# EAGLE schematic YaoGuai_SOUND_v1 (EAGLE 8.1.1)
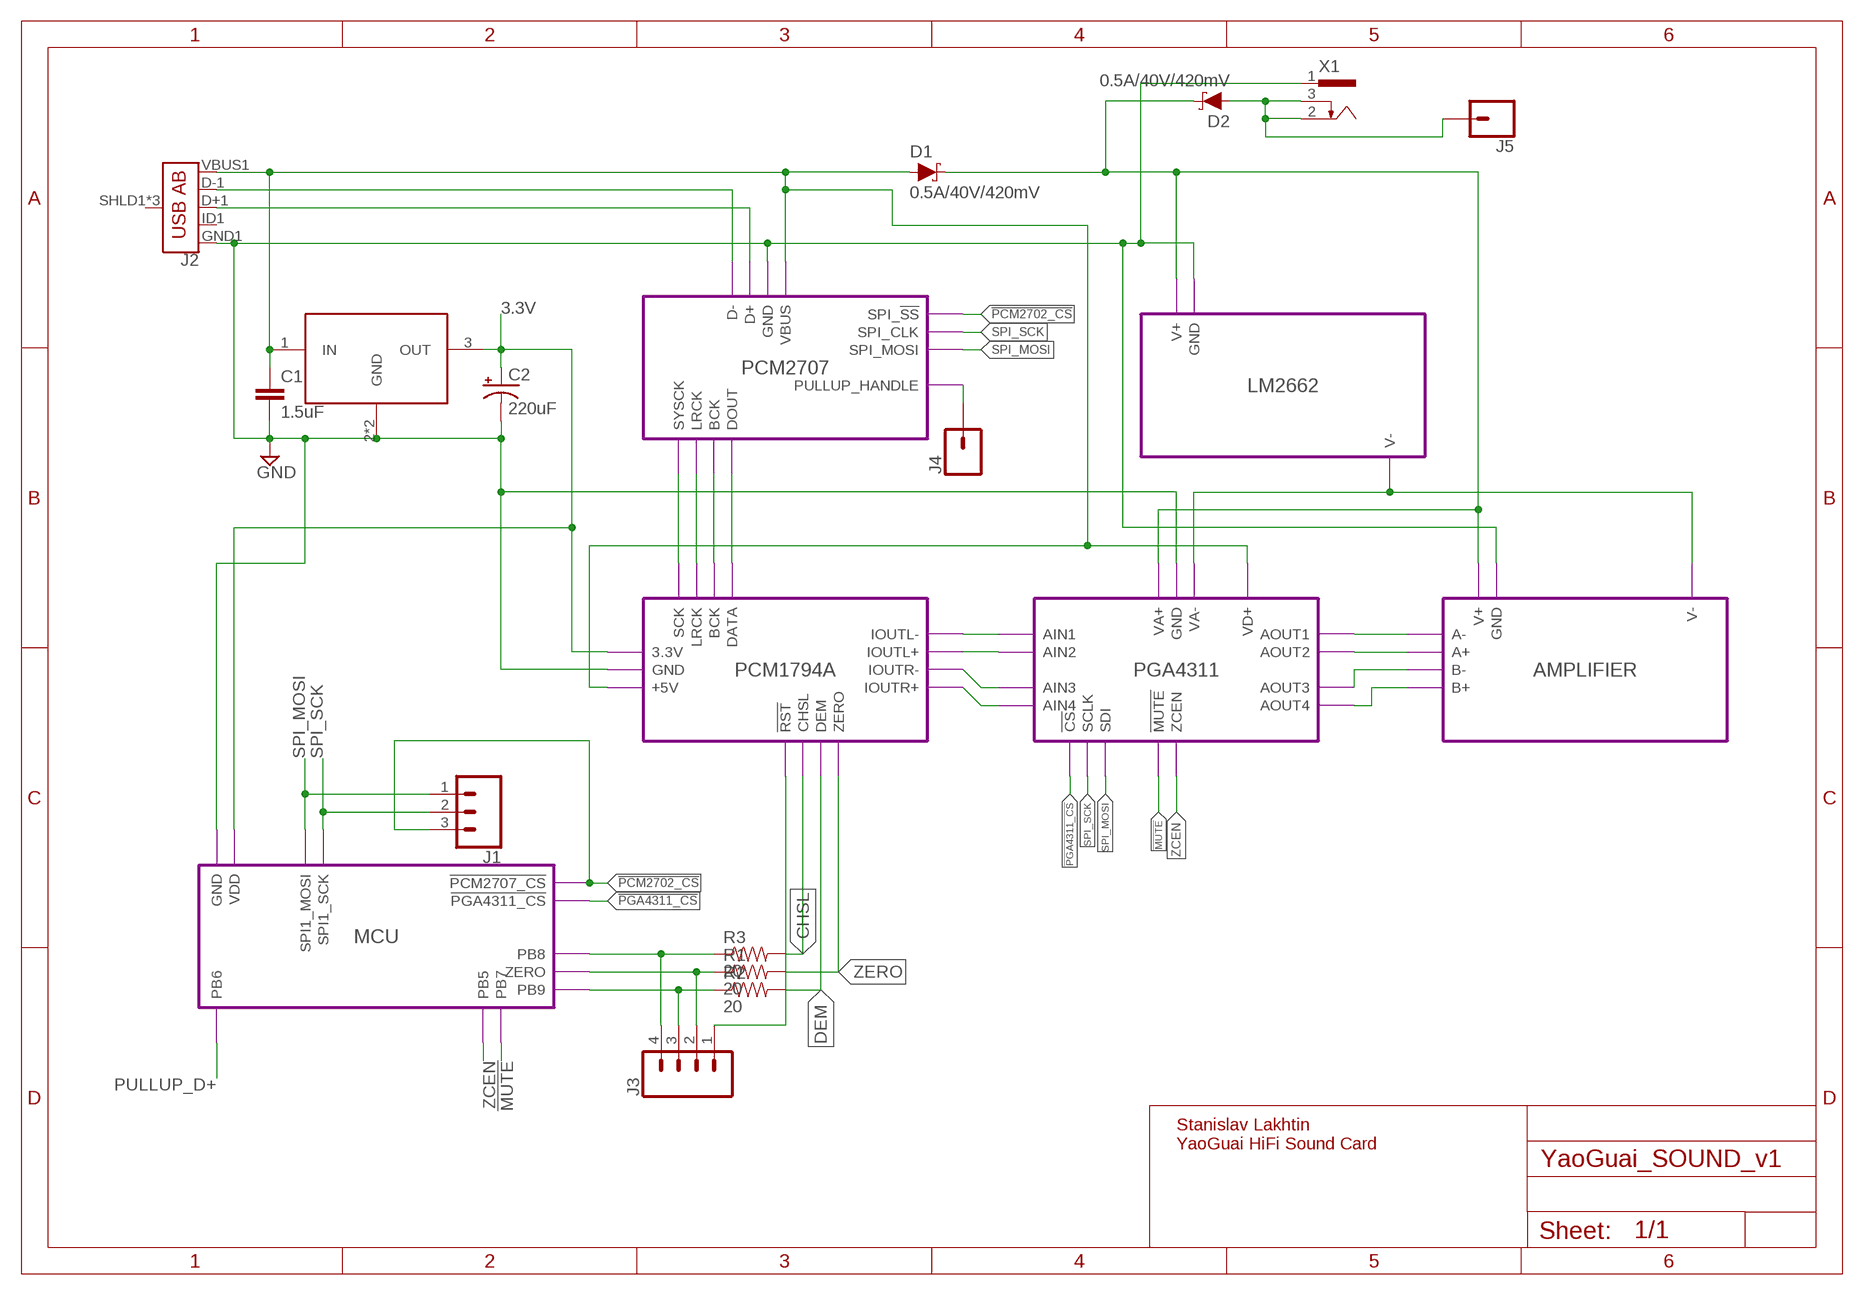
[diagram p0: schematic, sheet 1]

## Parts
C1  1.5uF  CAP0805  [0805]
C2  220uF  CAP_POLD  [PANASONIC_D]
D1  0.5A/40V/420mV  DIODE-SCHOTTKY-PMEG4005EJ  [SOD-323]
D2  0.5A/40V/420mV  DIODE-SCHOTTKY-PMEG4005EJ  [SOD-323]
J1  CONN_03  [1X03]
J2  USB_AB_SMT  [USB-AB-MICRO-SMD]
J3  CONN_04  [1X04]
J4  CONN_01  [1X01]
J5  CONN_01  [1X01]
R1  20  RESISTOR0805-RES  [0805]
R2  20  RESISTOR0805-RES  [0805]
R3  20  RESISTOR0805-RES  [0805]
U$1  LM3940IMP-3.3/NOPB  [SOT223]
X1  733980-62  [733980-62]

## Module instances
PCM2707 = PCM2707
LM2662 = VOLTAGE_CONVERTER
PCM1794A = PCM1794A
AMPLIFIER = AMPLIFIER
PGA4311 = PGA4311
MCU = MCU

## Nets
3.3V: C2.+ U$1.3(OUT) ; port PCM1794A.3.3V MCU.VDD
!MUTE!: port MCU.PB7 PGA4311.!MUTE!
!PCM2702_CS!: J1.3 ; port PCM2707.SPI_!SS! MCU.!PCM2707_CS!
!PGA4311_CS!: port PGA4311.!CS! MCU.!PGA4311_CS!
CHSL: R3.2 ; port PCM1794A.CHSL
DEM: R2.2 ; port PCM1794A.DEM
EXT+5V: D2.A J5.1 X1.2 X1.3
GND: C1.2 C2.- J2.GND1(GND) U$1.2(GND) U$1.4(GND) X1.1 ; port PCM1794A.GND PGA4311.GND MCU.GND PCM2707.GND AMPLIFIER.GND LM2662.GND
N$1: J2.D-1(D-) ; port PCM2707.D-
N$2: J2.D+1(D+) ; port PCM2707.D+
N$3: port PCM1794A.IOUTL- PGA4311.AIN1
N$4: port PGA4311.AIN2 PCM1794A.IOUTL+
N$5: port PCM1794A.SCK PCM2707.SYSCK
N$6: port PCM1794A.LRCK PCM2707.LRCK
N$7: port PCM1794A.BCK PCM2707.BCK
N$8: port PCM1794A.DATA PCM2707.DOUT
N$9: port PCM1794A.IOUTR- PGA4311.AIN3
N$10: port PCM1794A.IOUTR+ PGA4311.AIN4
N$11: J3.2 R1.1 ; port MCU.ZERO
N$12: J3.3 R2.1 ; port MCU.PB9
N$13: J3.4 R3.1 ; port MCU.PB8
N$14: J3.1 ; port PCM1794A.!RST!
N$20: port PGA4311.AOUT3 AMPLIFIER.B-
N$21: port PGA4311.AOUT4 AMPLIFIER.B+
N$22: port PGA4311.AOUT2 AMPLIFIER.A+
N$23: port PGA4311.AOUT1 AMPLIFIER.A-
PULLUP_D+: J4.1 ; port PCM2707.PULLUP_HANDLE MCU.PB6
SPI_MOSI: J1.1 ; port MCU.SPI1_MOSI PGA4311.SDI PCM2707.SPI_MOSI
SPI_SCK: J1.2 ; port PGA4311.SCLK MCU.SPI1_SCK PCM2707.SPI_CLK
USB+5V: C1.1 D1.A J2.VBUS1(VBUS) U$1.1(IN) ; port PCM2707.VBUS PCM1794A.+5V PGA4311.VD+
V+: D1.C D2.C ; port AMPLIFIER.V+ PGA4311.VA+ LM2662.V+
V-: port LM2662.V- AMPLIFIER.V- PGA4311.VA-
ZCEN: port MCU.PB5 PGA4311.ZCEN
ZERO: R1.2 ; port PCM1794A.ZERO
Unconnected: J2.ID1(USBID) J2.SHLD1(SHIELD) J2.SHLD2(SHIELD) J2.SHLD3(SHIELD)

## Notes on the sheet
- Stanislav Lakhtin 
  YaoGuai HiFi Sound Card

## Library data of the parts
C1 = SparkFun-Passives:CAP: Capacitor Standard 0603 ceramic capacitor, and 0.1" leaded capacitor.
C2 = SparkFun-Passives:CAP_POL: Capacitor Polarized These are standard SMD and PTH capacitors. Normally 10uF, 47uF, and 100uF in electrolytic and tantalum varieties. Always verify the external diameter of the through hole cap, it varies with capacity, voltage, and manufacturer. The EIA devices should be standard.
D1 D2 = SparkFun-DiscreteSemi:DIODE-SCHOTTKY: Schottky diode A Schottky diode is a semiconductor diode which has a low forward voltage drop and a very fast switching action.; PROD_ID: DIO-10955
J1 = SparkFun-Connectors:CONN_03: Multi connection point. Often used as Generic Header-pin footprint for 0.1 inch spaced/style header connections On any of the 0.1 inch spaced packages, you can populate with these: Break Away Headers - Straight <https://www.sparkfun.com/products/116> (PRT-00116) Break Away Male Headers - Right Angle <https://www.sparkfun.com/products/553> (PRT-00553) Female Headers <https://www.sparkfun.com/products/115> (PRT-00115) Break Away Headers - Machine Pin <https://www.sparkfun.com/products/117> (PRT-00117) Break Away Female Headers - Swiss Machine Pin <https://www.sparkfun.com/products/743> (PRT-00743) Stackable Header - 3 Pin (Female, 0.1") <https://www.sparkfun.com/products/13875> (PRT-13875) For SCREWTERMINALS and SPRING TERMINALS visit here: Screw Terimnals on SparkFun.com <https://www.sparkfun.com/search/results?term=Screw+Terminals> (5mm/3.5mm/2.54mm spacing) This device is also useful as a general connection point to wire up your design to another part of your project. Our various solder wires solder well into these plated through hole pads. Hook-Up Wire - Assortment (Stranded, 22 AWG) <https://www.sparkfun.com/products/11375> (PRT-11375) Hook-Up Wire - Assortment (Solid Core, 22 AWG) <https://www.sparkfun.com/products/11367> (PRT-11367) View the entire wire category on our website here <https://www.sparkfun.com/categories/141> Special notes: Molex polarized connector foot print use with SKU : PRT-08232 with associated crimp pins and housings.
J2 = SparkFun-Connectors:USB_AB: USB Type AB Micro Connector OTG-compatible. 5 pins, 3 shield pins SparkFun Products: IOIO-OTG <https://www.sparkfun.com/products/13613> SparkFun SAMD21 Mini Breakout <https://www.sparkfun.com/products/13664>; PROD_ID: CONN-11794
J3 = SparkFun-Connectors:CONN_04: Multi connection point. Often used as Generic Header-pin footprint for 0.1 inch spaced/style header connections On any of the 0.1 inch spaced packages, you can populate with these: Break Away Headers - Straight <https://www.sparkfun.com/products/116> (PRT-00116) Break Away Male Headers - Right Angle <https://www.sparkfun.com/products/553> (PRT-00553) Female Headers <https://www.sparkfun.com/products/115> (PRT-00115) Break Away Headers - Machine Pin <https://www.sparkfun.com/products/117> (PRT-00117) Break Away Female Headers - Swiss Machine Pin <https://www.sparkfun.com/products/743> (PRT-00743) For SCREWTERMINALS and SPRING TERMINALS visit here: Screw Terimnals on SparkFun.com <https://www.sparkfun.com/search/results?term=Screw+Terminals> (5mm/3.5mm/2.54mm spacing) This device is also useful as a general connection point to wire up your design to another part of your project. Our various solder wires solder well into these plated through hole pads. Hook-Up Wire - Assortment (Stranded, 22 AWG) <https://www.sparkfun.com/products/11375> (PRT-11375) Hook-Up Wire - Assortment (Solid Core, 22 AWG) <https://www.sparkfun.com/products/11367> (PRT-11367) View the entire wire category on our website here <https://www.sparkfun.com/categories/141> Special notes: Molex polarized connector foot print use with SKU : PRT-08231 with associated crimp pins and housings. 1MM SMD Version SKU: PRT-10208; PROD_ID: CONN-09696
J4 J5 = SparkFun-Connectors:CONN_01: Single connection point. Often used as Generic Header-pin footprint for 0.1 inch spaced/style header connections On any of the 0.1 inch spaced packages, you can populate with these: Break Away Headers - Straight <https://www.sparkfun.com/products/116> (PRT-00116) Break Away Male Headers - Right Angle <https://www.sparkfun.com/products/553> (PRT-00553) Female Headers <https://www.sparkfun.com/products/115> (PRT-00115) Break Away Headers - Machine Pin <https://www.sparkfun.com/products/117> (PRT-00117) Break Away Female Headers - Swiss Machine Pin <https://www.sparkfun.com/products/743> (PRT-00743) This device is also useful as a general connection point to wire up your design to another part of your project. Our various solder wires solder well into these plated through hole pads. Hook-Up Wire - Assortment (Stranded, 22 AWG) <https://www.sparkfun.com/products/11375> (PRT-11375) Hook-Up Wire - Assortment (Solid Core, 22 AWG) <https://www.sparkfun.com/products/11367> (PRT-11367) View the entire wire category on our website here <https://www.sparkfun.com/categories/141> Special notes: SMTSO-256-ET is a "flush mount" nut for a 4-40 screw. We mostly use this on specialty testbeds; it is a nice way to connect hardware to your PCB at an adjustable hieght. Also note, the SNAP packages are for using a snappable style connector. We sell a baggie of snaps and they are also used on two LilyPad designs: Snap Assortment - 30 pack (male and female) <https://www.sparkfun.com/products/11347> (DEV-11347) LilyPad Arduino SimpleSnap <https://www.sparkfun.com/products/10941> (DEV-10941) LilyPad SimpleSnap Protoboard <https://www.sparkfun.com/products/10940> (DEV-10940)
R1-R3 = SparkFun-Passives:RESISTOR: Resistor Basic schematic elements and footprints for 0603, 1206, and PTH resistors.
U$1 = EduAreaLib:LM3940IMP-3.3/NOPB
X1 = con-conrad:73398?: FEMALE PRINT CONNECTOR Niedervolt-Steckverbinder Distributor Conrad

## Module PCM2707
Ports: D+(io) D-(io) GND(pwr) VBUS(pwr) SYSCK(io) LRCK(io) BCK(io) DOUT(io) SPI_!SS!(io) SPI_CLK(io) SPI_MOSI(io) PULLUP_HANDLE(io)
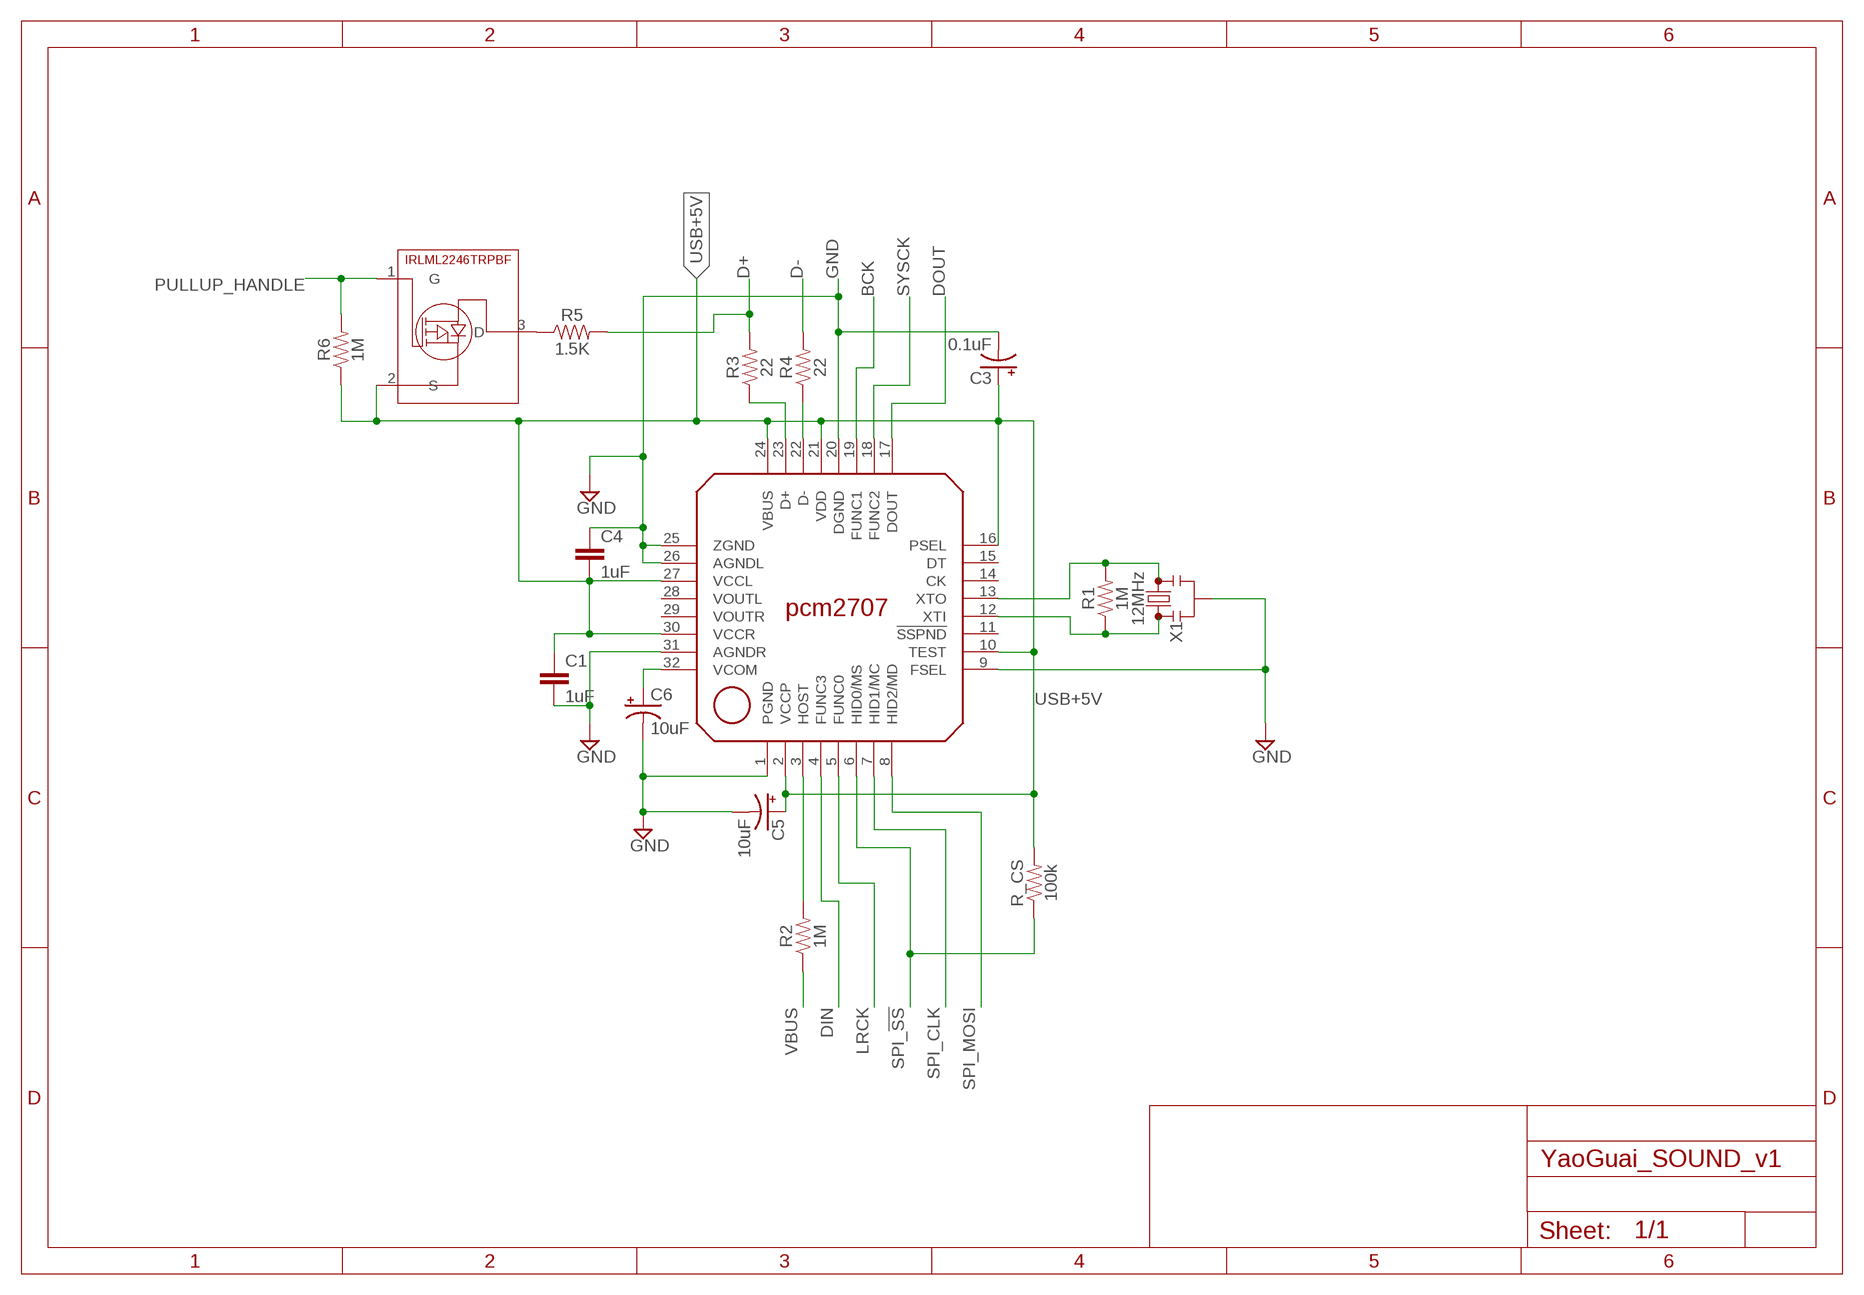
[diagram p1: schematic, module PCM2707, sheet 1]

### Parts
C1  1uF  CAP0805  [0805]
C3  0.1uF  CAP_POLD  [PANASONIC_D]
C4  1uF  CAP0805  [0805]
C5  10uF  CAP_POLD  [PANASONIC_D]
C6  10uF  CAP_POLD  [PANASONIC_D]
R1  1M  RESISTOR0805  [0805]
R2  1M  RESISTOR0805  [0805]
R3  22  RESISTOR0805  [0805]
R4  22  RESISTOR0805  [0805]
R5  1.5K  RESISTOR0805  [0805]
R6  1M  RESISTOR0805  [0805]
R_CS  100k  RESISTOR0805  [0805]
U$1  PCM2707  [TQFP32-0.8-7X7MM]
U$2  IRLML2246TRPBF  [SOT23-3]
X1  12MHz  RESONATOR-8MHZSMD_3.2X1.3  [RESONATOR-SMD-3.2X1.3]

### Nets
BCK: U$1.19(FUNC1)
D+: R3.2 R5.2
D-: R4.2
DIN: U$1.4(FUNC3)
DOUT: U$1.17(DOUT)
GND: C1.2 C3.- C4.1 C5.- C6.- U$1.1(PGND) U$1.9(FSEL) U$1.20(DGND) U$1.25(ZGND) U$1.26(AGNDL) U$1.31(AGNDR) X1.2
INTRNL_D+: R3.1 U$1.23(D+)
INTRNL_D-: R4.1 U$1.22(D-)
INTRNL_HOST: R2.2 U$1.3(HOST)
LRCK: U$1.5(FUNC0)
N$9: R5.1 U$2.3(D)
PULLUP_HANDLE: R6.2 U$2.1(G)
RESONATOR_XTI: R1.1 U$1.12(XTI) X1.1
RESONATOR_XTO: R1.2 U$1.13(XTO) X1.3
SPI_!SS!: R_CS.1 U$1.6(HID0/MS)
SPI_CLK: U$1.7(HID1/MC)
SPI_MOSI: U$1.8(HID2/MD)
SYSCK: U$1.18(FUNC2)
USB+5V: C1.1 C3.+ C4.2 C5.+ R6.1 R_CS.2 U$1.2(VCCP) U$1.10(TEST) U$1.16(PSEL) U$1.21(VDD) U$1.24(VBUS) U$1.27(VCCL) U$1.30(VCCR) U$2.2(S)
VBUS: R2.1
VCOM: C6.+ U$1.32(VCOM)
Unconnected: U$1.11(!SSPND!) U$1.14(CK) U$1.15(DT) U$1.28(VOUTL) U$1.29(VOUTR)

### Library data of the parts
C1 C4 = SparkFun-Passives:CAP: Capacitor Standard 0603 ceramic capacitor, and 0.1" leaded capacitor.
C3 C5 C6 = SparkFun-Passives:CAP_POL: Capacitor Polarized These are standard SMD and PTH capacitors. Normally 10uF, 47uF, and 100uF in electrolytic and tantalum varieties. Always verify the external diameter of the through hole cap, it varies with capacity, voltage, and manufacturer. The EIA devices should be standard.
R1-R6 R_CS = SparkFun-Resistors:RESISTOR: Generic Resistor Package
U$1 = EduAreaLib:PCM2707
U$2 = EduAreaLib:IRLML2246TRPBF
X1 = SparkFun-Clocks:RESONATOR-8MHZ: 8MHz Resonator Digikey Example <http://www.digikey.com/product-detail/en/murata-electronics-north-america/CSTCE10M0G55-R0/490-1196-1-ND/584633> Frequency: 8MHz Frequency Stability: ±0.2% Frequency Tolerance: ±0.5% Capacitance: 33pF SparkFun Products Arduino Pro Mini 328- 3.3V/8MHz <https://www.sparkfun.com/products/11114> SparkFun Digital Sandbox <https://www.sparkfun.com/products/12651>; PROD_ID: XTAL-08895; VALUE: 8MHz

## Module VOLTAGE_CONVERTER
Ports: GND(pwr) V+(pwr) V-(pwr)
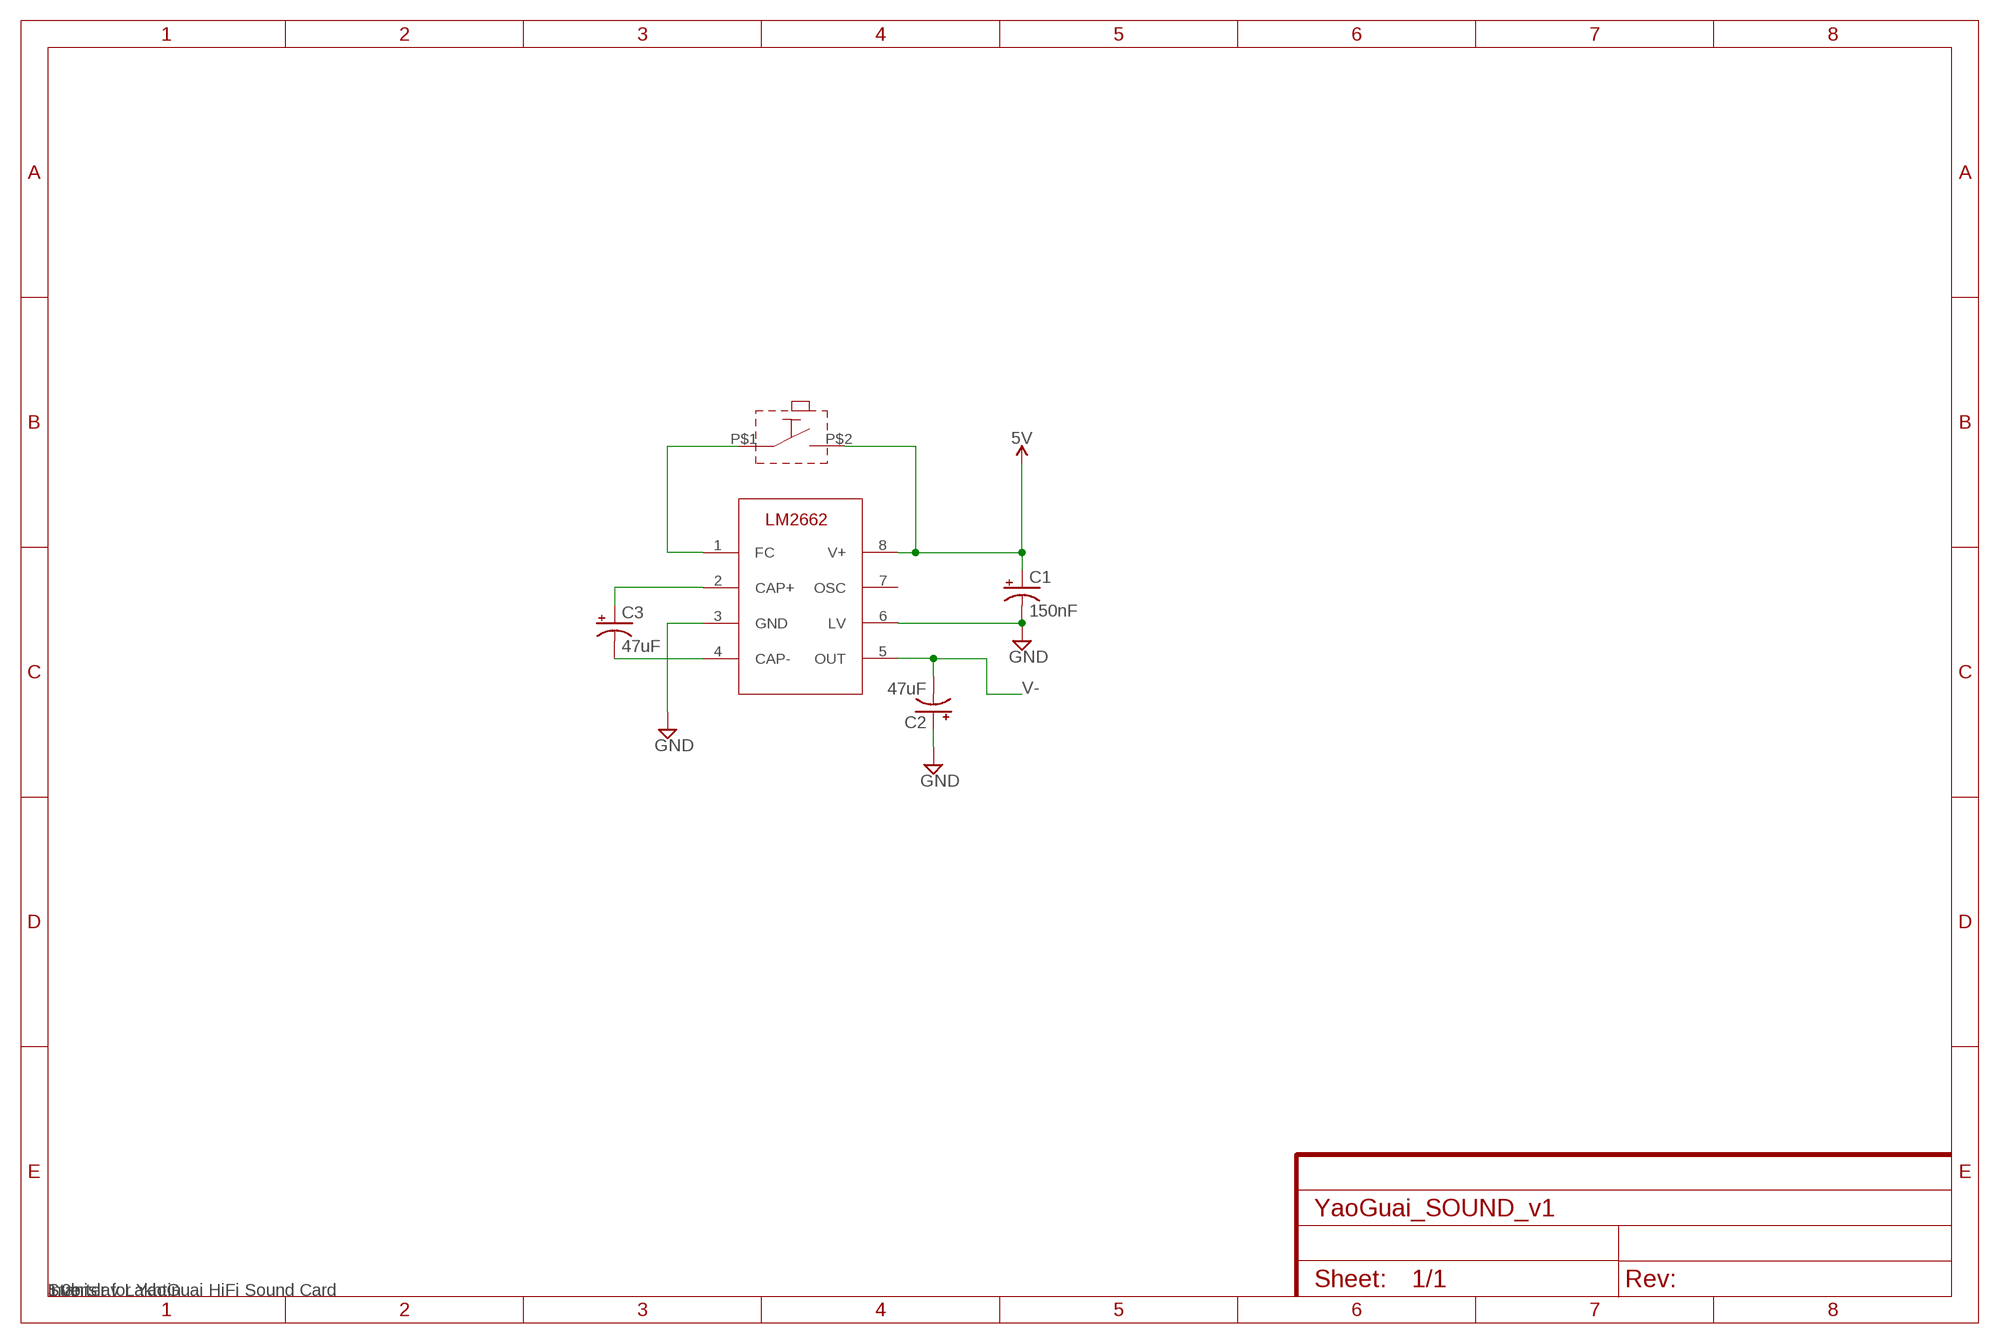
[diagram p2: schematic, module VOLTAGE_CONVERTER, sheet 1]
FRAME1 (FRAME-A4L): CNAME: Inverter for YaoGuai HiFi Sound Card; CREVISION: 1.0b; DESIGNER: Stanislav Lakhtin

### Parts
C1  150nF  CAP_POLD  [PANASONIC_D]
C2  47uF  CAP_POLD  [PANASONIC_D]
C3  47uF  CAP_POLD  [PANASONIC_D]
U$1  LM2662  [SOIC-8]
U$2  RED_SWITCH_ON  [RED_SWITCH]

### Nets
FC: U$1.1(FC) U$2.P$1
GND: C1.- C2.+ U$1.3(GND) U$1.6(LV)
N$1: C3.+ U$1.2(CAP+)
N$2: C3.- U$1.4(CAP-)
V+: C1.+ U$1.8(V+) U$2.P$2 ; supply symbol labelled 5V
V-: C2.- U$1.5(OUT)
Unconnected: U$1.7(OSC)

### Library data of the parts
C1-C3 = SparkFun-Passives:CAP_POL: Capacitor Polarized These are standard SMD and PTH capacitors. Normally 10uF, 47uF, and 100uF in electrolytic and tantalum varieties. Always verify the external diameter of the through hole cap, it varies with capacity, voltage, and manufacturer. The EIA devices should be standard.
U$1 = EduAreaLib:LM2662: The LM2662/LM2663 CMOS charge-pump voltage converter inverts a positive voltage in the range of 1.5 V to 5.5 V to the corresponding negative voltage. The LM2662/LM2663 uses two low cost capacitors to provide 200 mA of output current without the cost, size, and EMI related to inductor based converters. With an operating current of only 300 μA and operating efficiency greater than 90% at most loads, the LM2662/LM2663 provides ideal performance for battery powered systems. The LM2662/LM2663 may also be used as a positive voltage doubler. The oscillator frequency can be lowered by adding an external capacitor to the OSC pin. Also, the OSC pin may be used to drive the LM2662/LM2663 with an external clock. For LM2662, a frequency control (FC) pin selects the oscillator frequency of 20 kHz or 150 kHz. For LM2663, an external shutdown (SD) pin replaces the FC pin. The SD pin can be used to disable the device and reduce the quiescent current to 10 μA. The oscillator frequency for LM2663 is 150 kHz.
U$2 = EduAreaLib:RED_SWITCH_ON

## Module PCM1794A
Ports: SCK(io) LRCK(io) BCK(io) DATA(io) 3.3V(pwr) GND(pwr) IOUTL-(out) IOUTL+(out) IOUTR-(out) IOUTR+(out) !RST!(io) CHSL(io) DEM(io) ZERO(io) +5V(io)
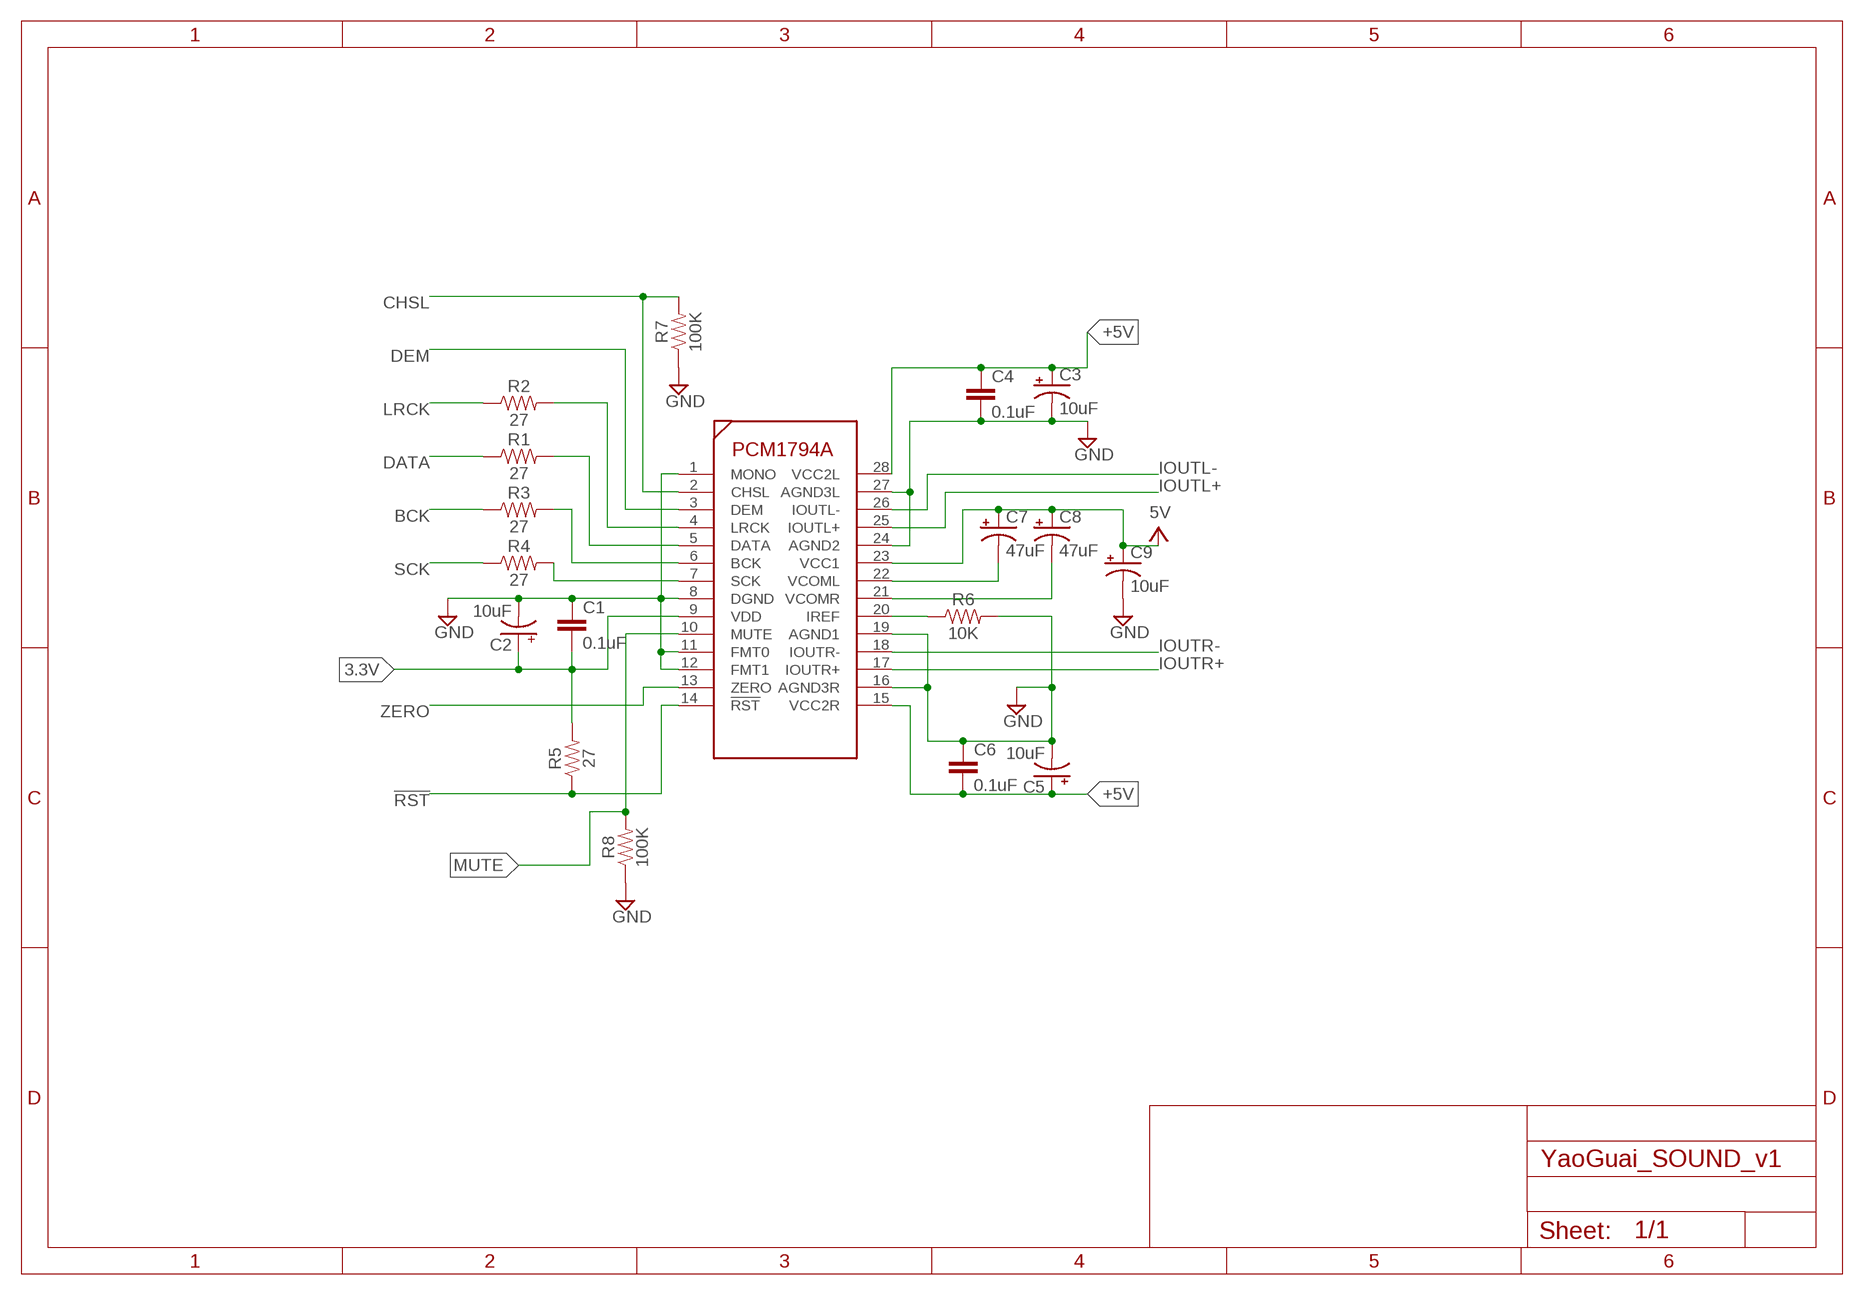
[diagram p3: schematic, module PCM1794A, sheet 1]

### Parts
C1  0.1uF  CAP0805  [0805]
C2  10uF  CAP_POLD  [PANASONIC_D]
C3  10uF  CAP_POLD  [PANASONIC_D]
C4  0.1uF  CAP0805  [0805]
C5  10uF  CAP_POLD  [PANASONIC_D]
C6  0.1uF  CAP0805  [0805]
C7  47uF  CAP_POLD  [PANASONIC_D]
C8  47uF  CAP_POLD  [PANASONIC_D]
C9  10uF  CAP_POLD  [PANASONIC_D]
R1  27  RESISTOR0805  [0805]
R2  27  RESISTOR0805  [0805]
R3  27  RESISTOR0805  [0805]
R4  27  RESISTOR0805  [0805]
R5  27  RESISTOR0805  [0805]
R6  10K  RESISTOR0805  [0805]
R7  100K  RESISTOR0805  [0805]
R8  100K  RESISTOR0805  [0805]
U$1  PCM1794A  [SSOP28-0.65-10.2X5.2MM]

### Nets
3.3V: C1.2 C2.+ R5.2 U$1.9(VDD)
!RST!: R5.1 U$1.14(!RST!)
+5V: C3.+ C4.1 C5.+ C6.2 U$1.15(VCC2R) U$1.28(VCC2L)
BCK: R3.1
CHSL: R7.2 U$1.2(CHSL)
DATA: R1.1
DEM: U$1.3(DEM)
GND: C1.1 C2.- C3.- C4.2 C5.- C6.1 C9.- R6.2 R7.1 R8.1 U$1.1(MONO) U$1.8(DGND) U$1.11(FMT0) U$1.12(FMT1) U$1.16(AGND3R) U$1.19(AGND1) U$1.24(AGND2) U$1.27(AGND3L)
IOUTL+: U$1.25(IOUTL+)
IOUTL-: U$1.26(IOUTL-)
IOUTR+: U$1.17(IOUTR+)
IOUTR-: U$1.18(IOUTR-)
LRCK: R2.1
MUTE: R8.2 U$1.10(MUTE)
N$1: R4.2 U$1.7(SCK)
N$2: R3.2 U$1.6(BCK)
N$3: R1.2 U$1.5(DATA)
N$4: R6.1 U$1.20(IREF)
N$5: R2.2 U$1.4(LRCK)
N$9: C7.- U$1.22(VCOML)
N$10: C8.- U$1.21(VCOMR)
SCK: R4.1
V+: C7.+ C8.+ C9.+ U$1.23(VCC1) ; supply symbol labelled 5V
ZERO: U$1.13(ZERO)

### Library data of the parts
C1 C4 C6 = SparkFun-Passives:CAP: Capacitor Standard 0603 ceramic capacitor, and 0.1" leaded capacitor.
C2 C3 C5 C7-C9 = SparkFun-Passives:CAP_POL: Capacitor Polarized These are standard SMD and PTH capacitors. Normally 10uF, 47uF, and 100uF in electrolytic and tantalum varieties. Always verify the external diameter of the through hole cap, it varies with capacity, voltage, and manufacturer. The EIA devices should be standard.
R1-R8 = SparkFun-Resistors:RESISTOR: Generic Resistor Package
U$1 = EduAreaLib:PCM1794A: The PCM1794A device is a monolithic, CMOS-integrated circuit that includes stereo digital-to-analog converters (DACs) and support circuitry in a small 28-pin SSOP package. The data converters use TI’s advanced segment DAC architecture to achieve excellent dynamic performance and improved tolerance to clock jitter. The PCM1794A device provides balanced current outputs, allowing the user to optimize analog performance externally. Sampling rates up to 200 kHz are supported.

## Module AMPLIFIER
Ports: A-(in) A+(in) B-(in) B+(in) V-(pwr) V+(pwr) GND(pwr)
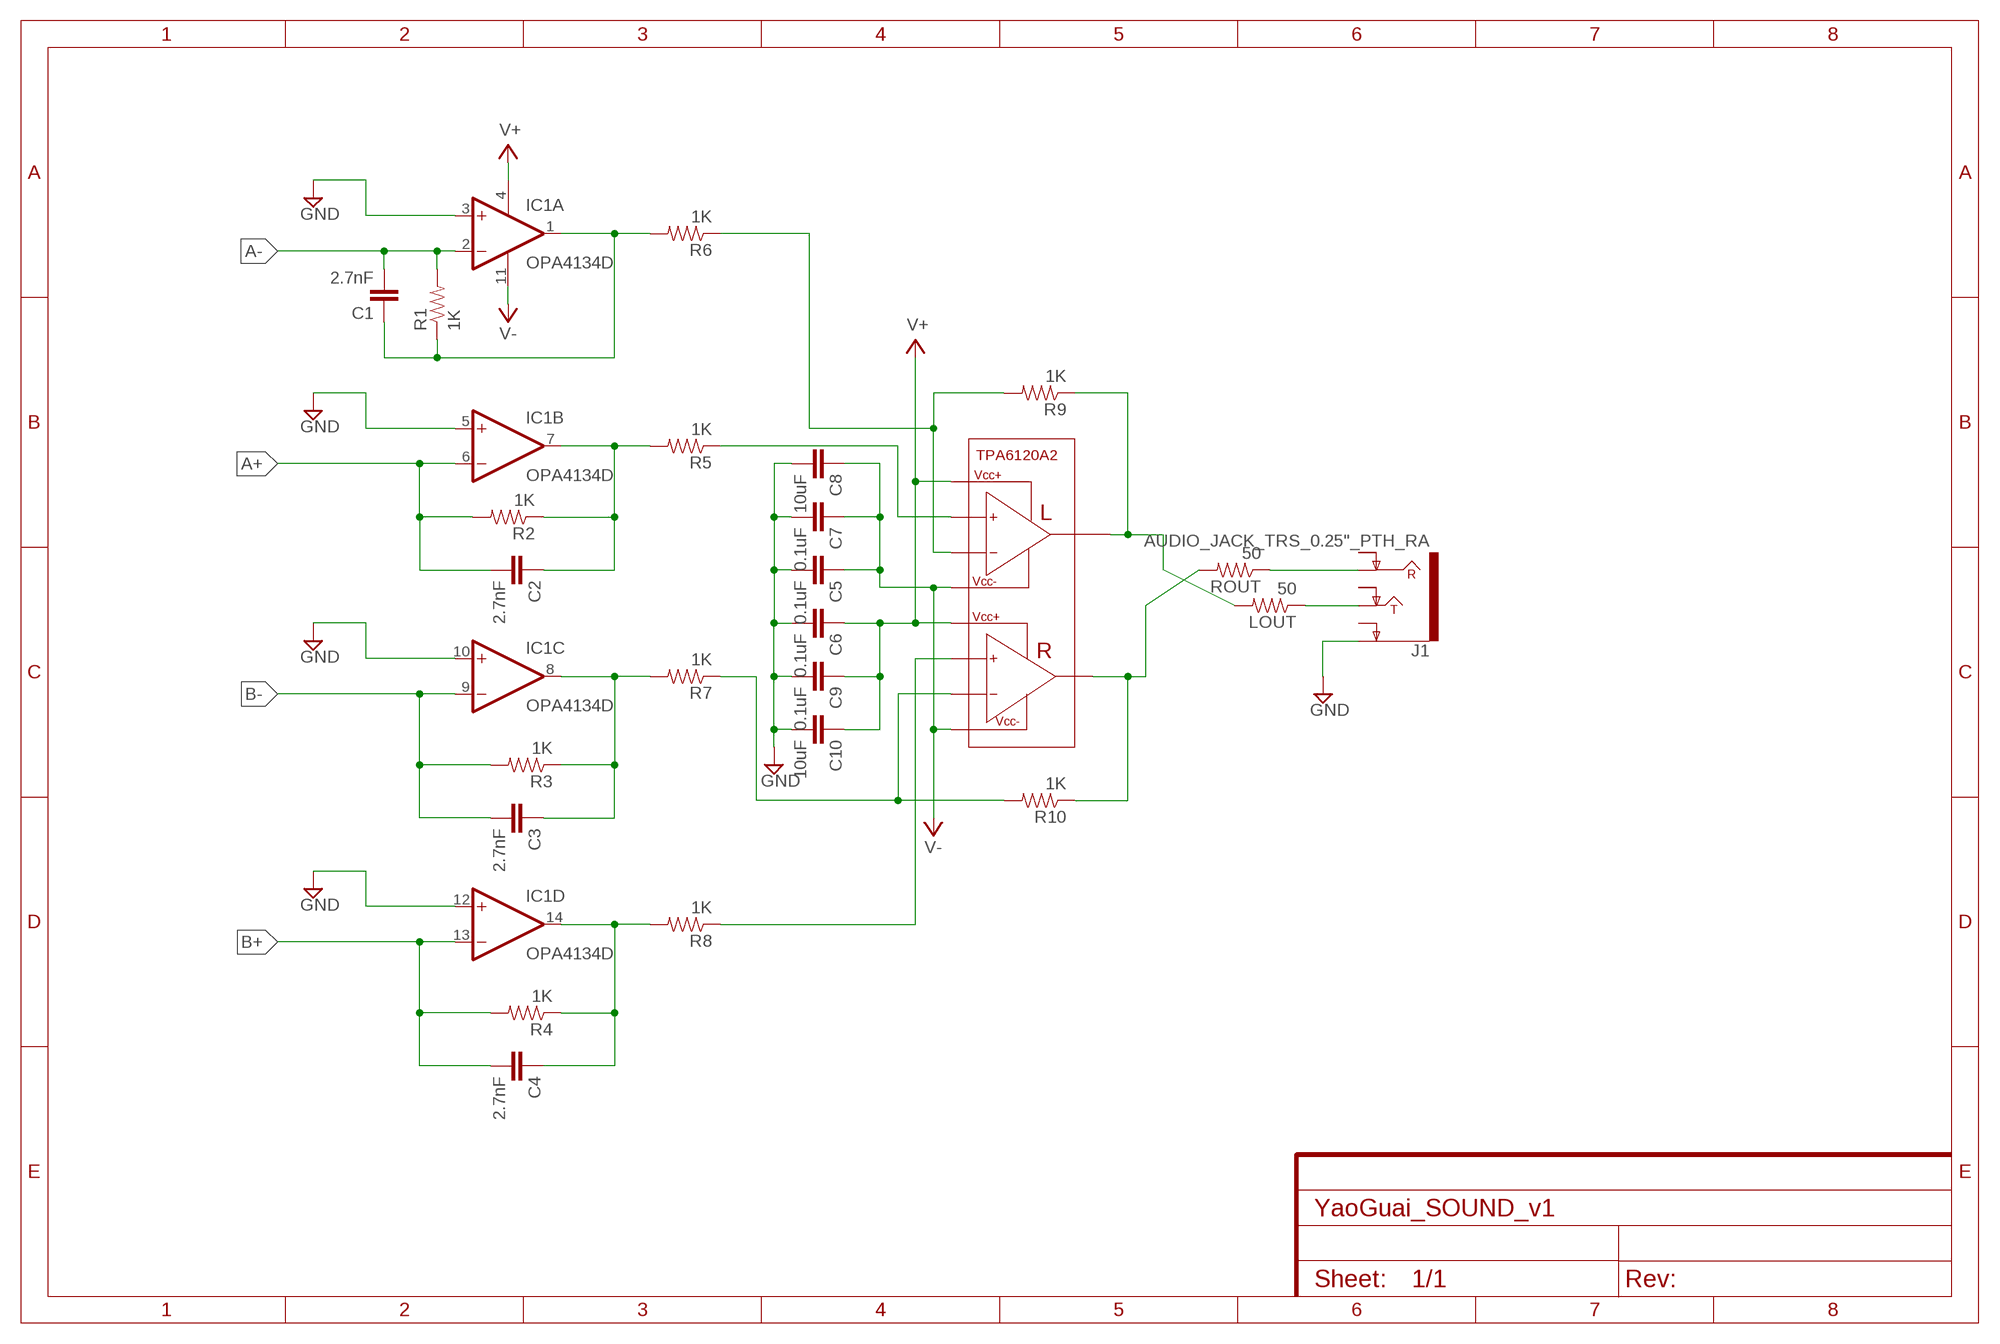
[diagram p4: schematic, module AMPLIFIER, sheet 1]

### Parts
C1  2.7nF  CAP0805  [0805]
C2  2.7nF  CAP0805  [0805]
C3  2.7nF  CAP0805  [0805]
C4  2.7nF  CAP0805  [0805]
C5  0.1uF  CAP0805  [0805]
C6  0.1uF  CAP0805  [0805]
C7  0.1uF  CAP0805  [0805]
C8  10uF  CAP0805  [0805]
C9  0.1uF  CAP0805  [0805]
C10  10uF  CAP0805  [0805]
IC1  OPA4134D  [SO14]
J1  AUDIO_JACK_TRS_0.25"_PTH_RA  [AUDIO_JACK_0.25"_TRS_PTH_RA]
LOUT  50  RESISTOR0805-RES  [0805]
R1  1K  RESISTOR0805-RES  [0805]
R2  1K  RESISTOR0805-RES  [0805]
R3  1K  RESISTOR0805-RES  [0805]
R4  1K  RESISTOR0805-RES  [0805]
R5  1K  RESISTOR0805-RES  [0805]
R6  1K  RESISTOR0805-RES  [0805]
R7  1K  RESISTOR0805-RES  [0805]
R8  1K  RESISTOR0805-RES  [0805]
R9  1K  RESISTOR0805-RES  [0805]
R10  1K  RESISTOR0805-RES  [0805]
ROUT  50  RESISTOR0805-RES  [0805]
U$1  TPA6120A2  [SOIC20S]

### Nets
A+: C2.2 IC1.6(B:-IN) R2.2
A-: C1.2 IC1.2(A:-IN) R1.2
B+: C4.2 IC1.13(D:-IN) R4.2
B-: C3.2 IC1.9(C:-IN) R3.2
GND: C5.2 C6.2 C7.2 C8.2 C9.2 C10.2 IC1.3(A:+IN) IC1.5(B:+IN) IC1.10(C:+IN) IC1.12(D:+IN) J1.SLEEVE(EARTH)
N$1: C1.1 IC1.1(A:OUT) R1.1 R6.2
N$2: R6.1 R9.2 U$1.5(LIN-)
N$3: R5.1 U$1.4(LIN+)
N$4: C2.1 IC1.7(B:OUT) R2.1 R5.2
N$5: R7.1 R10.2 U$1.16(RIN-)
N$6: R8.1 U$1.17(RIN+)
N$7: C3.1 IC1.8(C:OUT) R3.1 R7.2
N$8: LOUT.2 R9.1 U$1.2(LOUT)
N$9: R10.1 ROUT.2 U$1.19(ROUT)
N$10: C4.1 IC1.14(D:OUT) R4.1 R8.2
N$11: J1.RING ROUT.1
N$12: J1.TIP LOUT.1
V+: C6.1 C9.1 C10.1 IC1.4(P:V+) U$1.3(LVCC+) U$1.18(RVCC+)
V-: C5.1 C7.1 C8.1 IC1.11(P:V-) U$1.1(LVCC-) U$1.20(RVCC-)
Unconnected: J1.RING-NORM J1.SLEEVE-NORM(EARTH-NORM) J1.TIP-NORM

### Library data of the parts
C1-C10 = SparkFun-Passives:CAP: Capacitor Standard 0603 ceramic capacitor, and 0.1" leaded capacitor.
IC1 = linear:OPA4134: SoundPLUS (TM) High Performance AUDIO OPERATIONAL AMPLIFIERS Source: http://focus.ti.com/lit/ds/sbos058/sbos058.pdf
J1 = SparkFun-Connectors:AUDIO_JACK_TRS_0.25"_PTH_RA: Audio Jack, 1/4" TRS jack, horizontal, PTH, aka "Phono jack" Find the connector here: Audio Jack - 1/4" Stereo (right angle) <https://www.sparkfun.com/products/11144> (COM-11144) Datasheet <http://cdn.sparkfun.com/datasheets/Components/General/JP-611%20DD.jpg> Note, although the datasheet and physical part are slightly different, this footprint was proven to mate well on the Proto Pedal. This device is used on these SparkFun Products: SparkFun TRS Jack Breakout - 1/4" Stereo <https://www.sparkfun.com/products/13005> (BOB-13005 ) SparkFun Proto Pedal - sorry bad link - product comming soon! <https://www.sparkfun.com/products/13124> (PRT-13124); PROD_ID: CONN-12339; SF_ID: COM-11144
LOUT R1-R10 ROUT = SparkFun-Passives:RESISTOR: Resistor Basic schematic elements and footprints for 0603, 1206, and PTH resistors.
U$1 = EduAreaLib:TPA6120A2: TPA6120A2 High Fidelity Headphone Amplifier

## Module PGA4311
Ports: AIN1(in) AIN2(in) AIN3(in) !CS!(in) AOUT1(out) AOUT2(out) AOUT3(out) AOUT4(out) AIN4(in) SCLK(in) SDI(in) GND(pwr) VA+(pwr) VA-(pwr) VD+(pwr) !MUTE!(in) ZCEN(in)
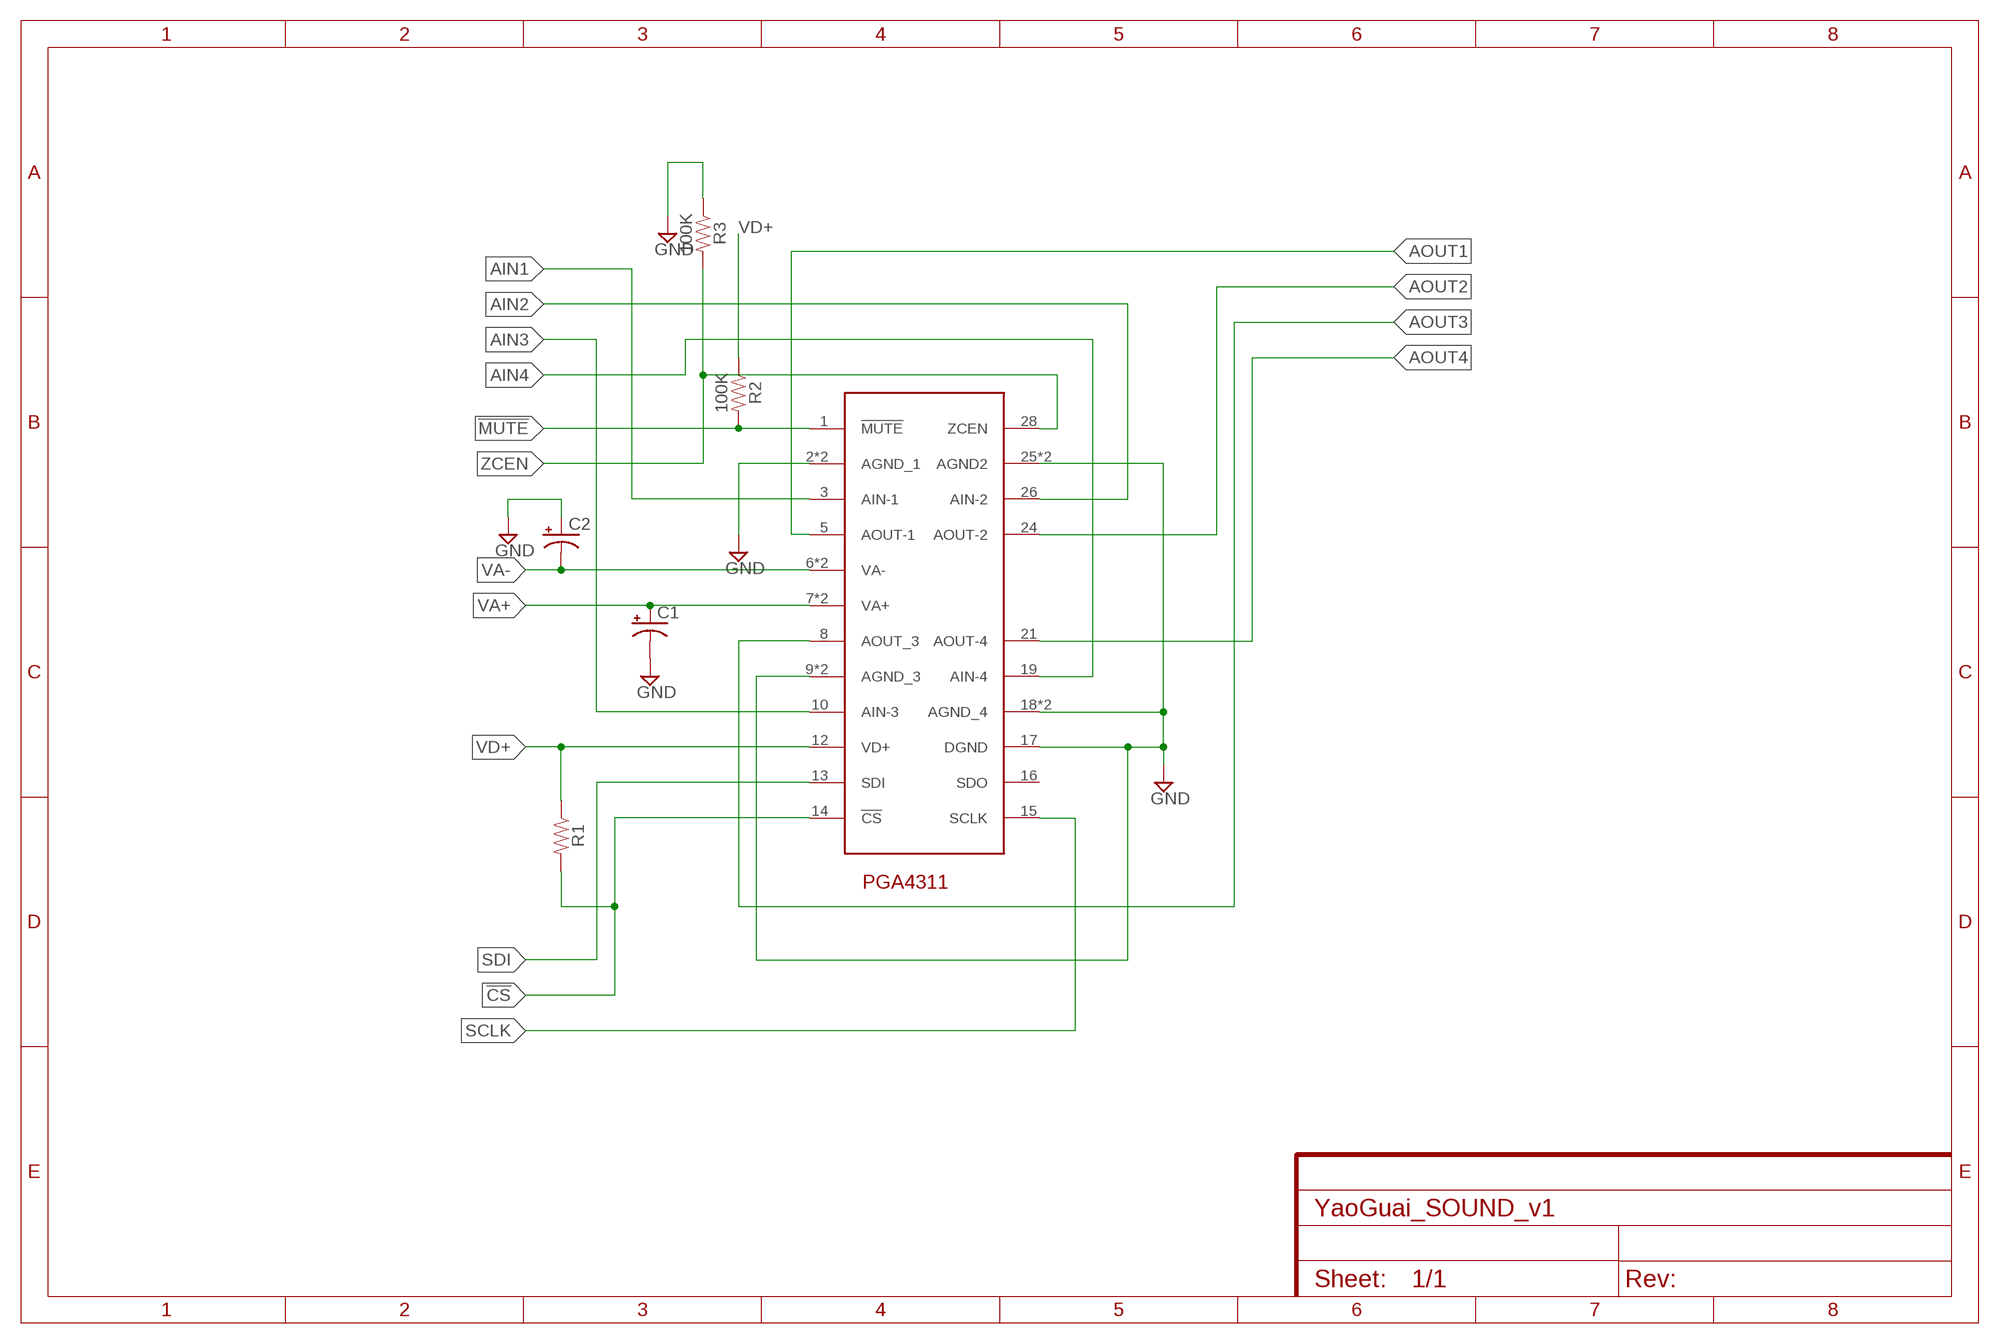
[diagram p5: schematic, module PGA4311, sheet 1]

### Parts
C1  CAP_POLD  [PANASONIC_D]
C2  CAP_POLD  [PANASONIC_D]
R1  RESISTOR0805  [0805]
R2  100K  RESISTOR0805  [0805]
R3  100K  RESISTOR0805  [0805]
U$1  PGA4311  [SOP28]

### Nets
!CS!: R1.2 U$1.14(!CS!)
!MUTE!: R2.2 U$1.1(!MUTE!)
AIN1: U$1.3(AIN-1)
AIN2: U$1.26(AIN-2)
AIN3: U$1.10(AIN-3)
AIN4: U$1.19(AIN-4)
AOUT1: U$1.5(AOUT-1)
AOUT2: U$1.24(AOUT-2)
AOUT3: U$1.8(AOUT_3)
AOUT4: U$1.21(AOUT-4)
GND: C1.- C2.+ R3.1 U$1.2(AGND_1) U$1.4(AGND_1) U$1.9(AGND_3) U$1.11(AGND_3) U$1.17(DGND) U$1.18(AGND_4) U$1.20(AGND_4) U$1.25(AGND2) U$1.27(AGND2)
SCLK: U$1.15(SCLK)
SDI: U$1.13(SDI)
VA+: C1.+ U$1.7(VA+) U$1.22(VA+)
VA-: C2.- U$1.6(VA-) U$1.23(VA-)
VD+: R1.1 R2.1 U$1.12(VD+)
ZCEN: R3.2 U$1.28(ZCEN)
Unconnected: U$1.16(SDO)

### Library data of the parts
C1 C2 = SparkFun-Passives:CAP_POL: Capacitor Polarized These are standard SMD and PTH capacitors. Normally 10uF, 47uF, and 100uF in electrolytic and tantalum varieties. Always verify the external diameter of the through hole cap, it varies with capacity, voltage, and manufacturer. The EIA devices should be standard.
R1-R3 = SparkFun-Resistors:RESISTOR: Generic Resistor Package
U$1 = EduAreaLib:PGA4311

## Module MCU
Ports: GND(io) VDD(io) !PCM2707_CS!(out) !PGA4311_CS!(out) SPI1_MOSI(out) SPI1_SCK(out) ZERO(io) PB9(io) PB8(io) PB7(io) PB6(io) PB5(io)
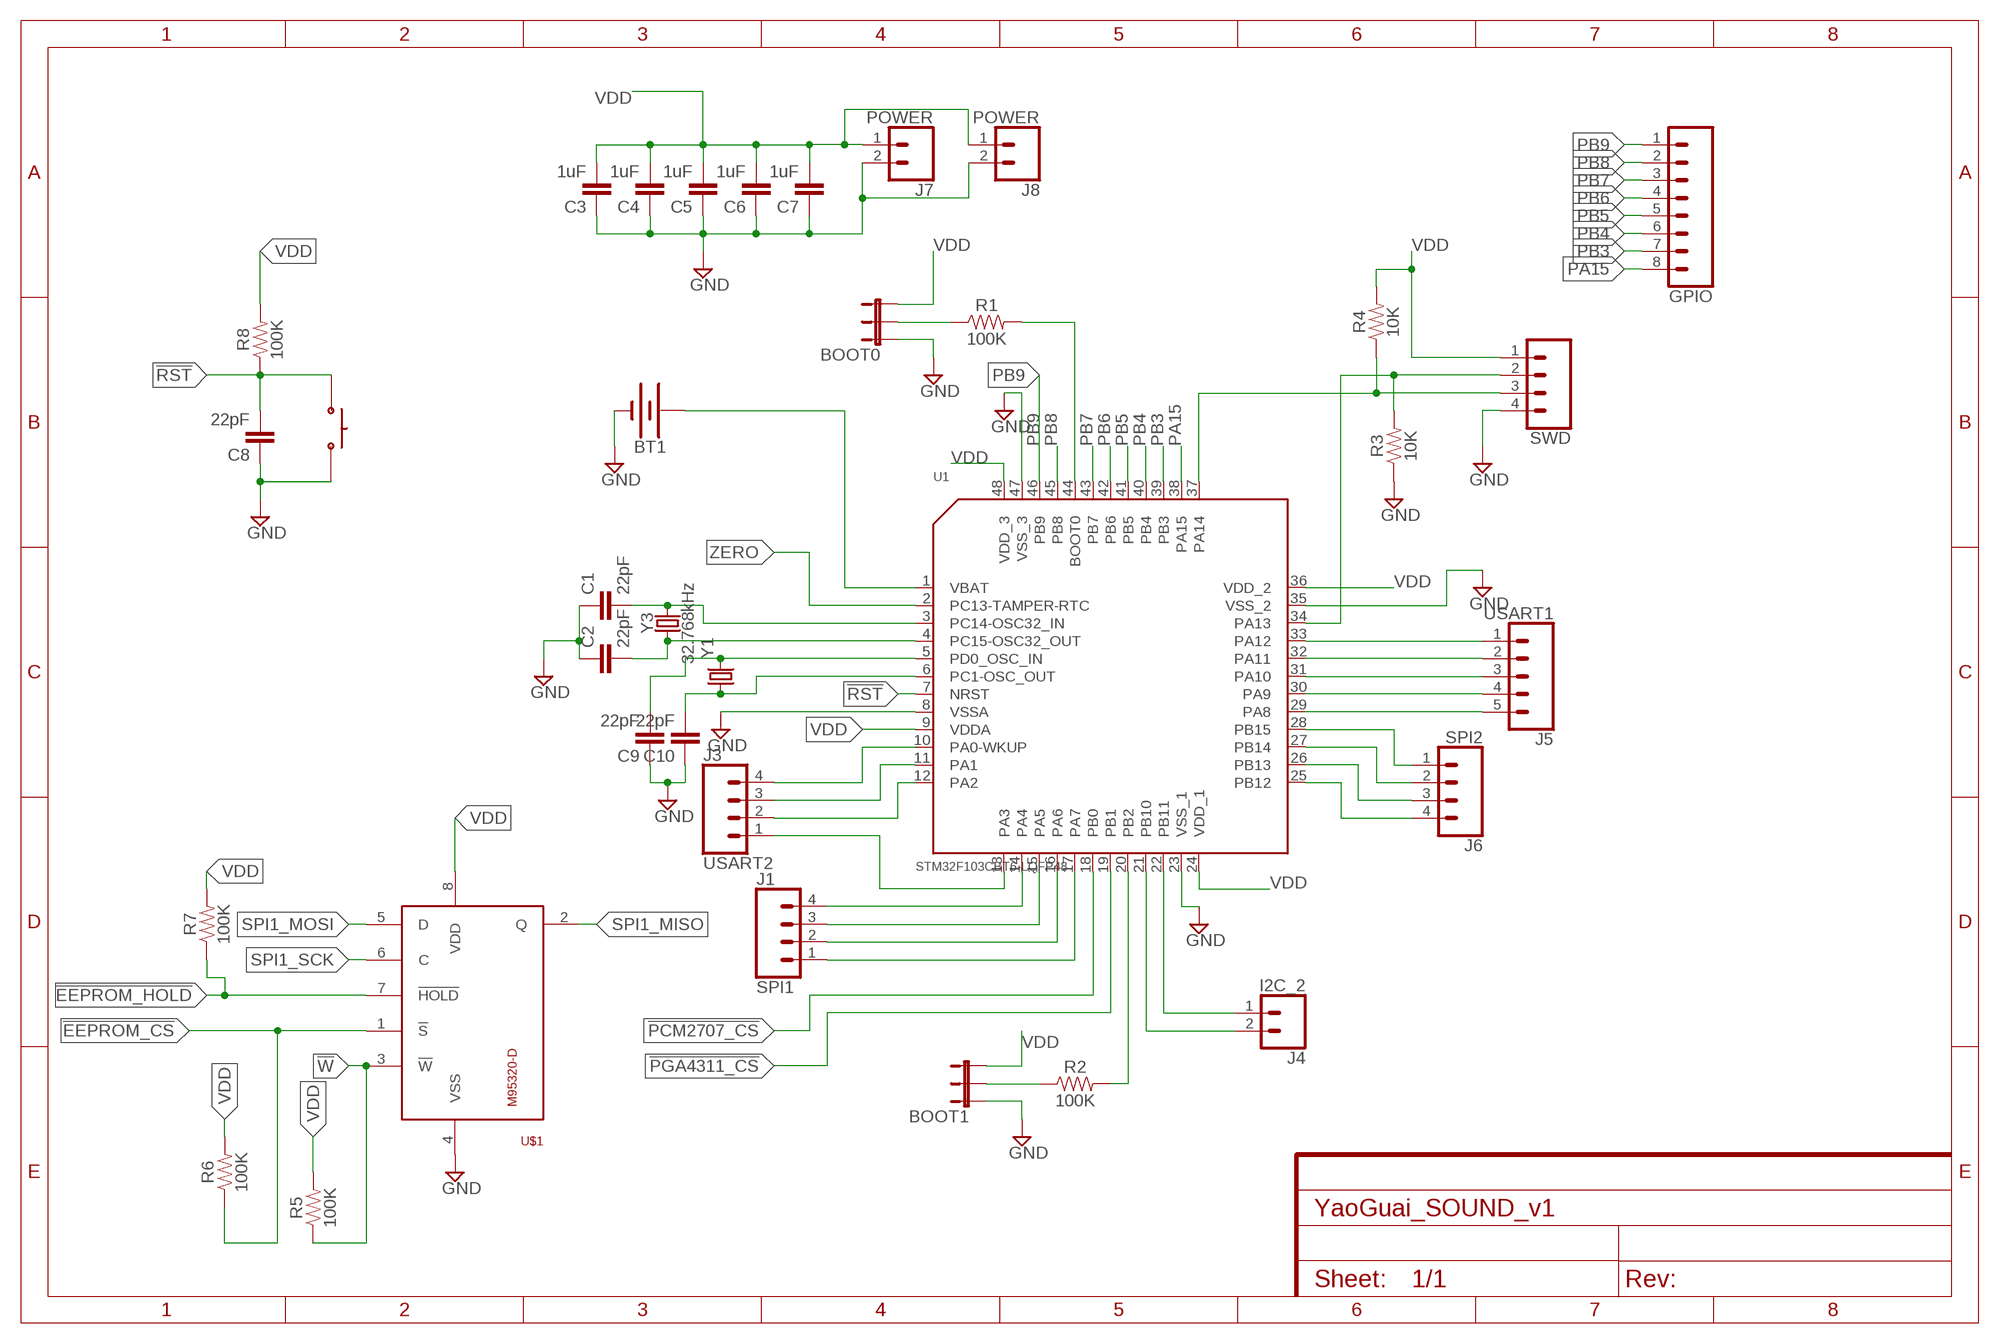
[diagram p6: schematic, module MCU, sheet 1]

### Parts
BOOT0  JUMPER-3PTH  [1X03]
BOOT1  JUMPER-3PTH  [1X03]
BT1  BATTERY-12MM_SMD  [BATTCON_12MM]
C1  22pF  CAP0805  [0805]
C2  22pF  CAP0805  [0805]
C3  1uF  CAP0805  [0805]
C4  1uF  CAP0805  [0805]
C5  1uF  CAP0805  [0805]
C6  1uF  CAP0805  [0805]
C7  1uF  CAP0805  [0805]
C8  22pF  CAP0805  [0805]
C9  22pF  CAP0805  [0805]
C10  22pF  CAP0805  [0805]
GPIO  CONN_08"  [1X08]
J1  SPI1  CONN_04  [1X04]
J3  USART2  CONN_04  [1X04]
J4  I2C_2  CONN_02  [1X02]
J5  USART1  CONN_05  [1X05]
J6  SPI2  CONN_04  [1X04]
J7  POWER  CONN_02  [1X02]
J8  POWER  CONN_02  [1X02]
R1  100K  RESISTOR0805  [0805]
R2  100K  RESISTOR0805  [0805]
R3  10K  RESISTOR0805  [0805]
R4  10K  RESISTOR0805  [0805]
R5  100K  RESISTOR0805  [0805]
R6  100K  RESISTOR0805  [0805]
R7  100K  RESISTOR0805  [0805]
R8  100K  RESISTOR0805  [0805]
SWD  CONN_04  [1X04]
U1  STM32F103CBT6-LQFP48  MCU-STM32F103CBT6(LQFP48)  [LQFP48-0.5-7X7MM]
U$1  M95320-D  [TSSOP8]
U$2  PUSHBUTTON  [PUSHBUTTON_4X4]
Y1  CRYSTALTXC-7A  [CRYSTAL-TXC-7A]
Y3  32.768kHz  CRYSTAL-32.768KHZPTH-2X6-KIT  [CRYSTAL-PTH-2X6-CYL-KIT]

### Nets
!EEPROM_CS!: R6.1 U$1.1(!S!)
!EEPROM_HOLD!: R7.1 U$1.7(!HOLD!)
!PCM2707_CS!: U1.18(PB0)
!PGA4311_CS!: U1.19(PB1)
!RST!: C8.2 R8.1 U1.7(NRST) U$2.P$1 U$2.P$2
!W!: R5.1 U$1.3(!W!)
GND: BOOT0.1 BOOT1.1 BT1.GND(-) C1.1 C2.1 C3.1 C4.1 C5.1 C6.1 C7.1 C8.1 C9.1 C10.1 J7.2 J8.2 R3.1 SWD.4 U1.8(VSSA) U1.23(VSS_1) U1.35(VSS_2) U1.47(VSS_3) U$1.4(VSS) U$2.P$3 U$2.P$4
I2C2_SCL: J4.2 U1.21(PB10)
I2C2_SDA: J4.1 U1.22(PB11)
N$1: BT1.PWR@1(+) U1.1(VBAT)
N$2: C10.2 U1.6(PC1-OSC_OUT) Y1.P$1
N$3: C9.2 U1.5(PD0_OSC_IN) Y1.P$2
N$4: C2.2 U1.4(PC15-OSC32_OUT) Y3.1
N$5: C1.2 U1.3(PC14-OSC32_IN) Y3.2
N$6: J5.3 U1.31(PA10)
N$7: BOOT0.2 R1.1
N$8: R1.2 U1.44(BOOT0)
N$9: J5.2 U1.32(PA11)
N$10: BOOT1.2 R2.1
N$11: R2.2 U1.20(PB2)
N$12: J5.1 U1.33(PA12)
N$14: J5.4 U1.30(PA9)
N$15: J5.5 U1.29(PA8)
PA15: GPIO.8 U1.38(PA15)
PB3: GPIO.7 U1.39(PB3)
PB4: GPIO.6 U1.40(PB4)
PB5: GPIO.5 U1.41(PB5)
PB6: GPIO.4 U1.42(PB6)
PB7: GPIO.3 U1.43(PB7)
PB8: GPIO.2 U1.45(PB8)
PB9: GPIO.1 U1.46(PB9)
SPI1_MISO: J1.2 U1.16(PA6) U$1.2(Q)
SPI1_MOSI: J1.1 U1.17(PA7) U$1.5(D)
SPI1_NSS: J1.4 U1.14(PA4)
SPI1_SCK: J1.3 U1.15(PA5) U$1.6(C)
SPI2_MISO: J6.2 U1.27(PB14)
SPI2_MOSI: J6.1 U1.28(PB15)
SPI2_NSS: J6.4 U1.25(PB12)
SPI2_SCK: J6.3 U1.26(PB13)
SWDCLK: R4.1 SWD.3 U1.37(PA14)
SWDIO: R3.2 SWD.2 U1.34(PA13)
USART2_CTS: J3.4 U1.10(PA0-WKUP)
USART2_RTS: J3.3 U1.11(PA1)
USART2_RX: J3.1 U1.13(PA3)
USART2_TX: J3.2 U1.12(PA2)
VDD: BOOT0.3 BOOT1.3 C3.2 C4.2 C5.2 C6.2 C7.2 J7.1 J8.1 R4.2 R5.2 R6.2 R7.2 R8.2 SWD.1 U1.9(VDDA) U1.24(VDD_1) U1.36(VDD_2) U1.48(VDD_3) U$1.8(VDD)
ZERO: U1.2(PC13-TAMPER-RTC)

### Library data of the parts
BOOT0 BOOT1 = SparkFun-Retired:JUMPER-3
BT1 = SparkFun-Batteries:BATTERY: Battery - Single Cell A variety of battery chemistries, sizes, and footprints. Device List: 20MM_PTH - Coin Cell Battery Holder - 20mm (PTH) <https://www.sparkfun.com/products/783> 12MM_SMD - Coin Cell Battery Holder - 12mm (SMD) <https://www.sparkfun.com/products/10592> 12MM_PTH - Coin Cell Battery Holder - 12mm (PTH) <https://www.sparkfun.com/products/7948> 20MM_SMD - 20mm Coin Cell Battery Holder (SMD) (2 legs) Used on the Big Time Watch Kit <https://www.sparkfun.com/products/11734> 20MM_SMD_4LEGS - Coin Cell Battery Holder - 20mm (SMD) <https://www.sparkfun.com/products/11892> 20MM_SMD_4LEGS_OVERPASTE - Coin Cell Battery Holder - 20mm (SMD) <https://www.sparkfun.com/products/11892> (Over-paste on the legs) 24.5MM_PTH - Coin Cell Battery Holder - 24.5mm (PTH) <https://www.sparkfun.com/products/8863> 9V - 9V Battery Holder - PC Mount Used on the SparkFun SparkPunk Sound Kit <https://www.sparkfun.com/products/11177> and SparkFun SparkPunk Sequencer Kit <https://www.sparkfun.com/products/12707> 18650 - Battery Holder - 18650 (PTH) <https://www.sparkfun.com/products/13113> AA - Battery Holder - 1xAA (PTH) <https://www.sparkfun.com/products/7949> AAA - Battery Holder - 1xAAA (PTH) <https://www.sparkfun.com/products/12718> AA_KIT - Battery Holder - 1xAA (PTH) <https://www.sparkfun.com/products/7949> Special kit package - pads only have exposed copper on one side of the board. AAA_KIT - Battery Holder - 1xAAA (PTH) <https://www.sparkfun.com/products/12718> Special kit package - pads only have exposed copper on one side of the board.; PROD_ID: BATT-08044; SF_SKU: PRT-10592
C1-C10 = SparkFun-Passives:CAP: Capacitor Standard 0603 ceramic capacitor, and 0.1" leaded capacitor.
GPIO = SparkFun-Connectors:CONN_08: Multi connection point. Often used as Generic Header-pin footprint for 0.1 inch spaced/style header connections On any of the 0.1 inch spaced packages, you can populate with these: Break Away Headers - Straight <https://www.sparkfun.com/products/116> (PRT-00116) Break Away Male Headers - Right Angle <https://www.sparkfun.com/products/553> (PRT-00553) Female Headers <https://www.sparkfun.com/products/115> (PRT-00115) Break Away Headers - Machine Pin <https://www.sparkfun.com/products/117> (PRT-00117) Break Away Female Headers - Swiss Machine Pin <https://www.sparkfun.com/products/743> (PRT-00743) Arduino Stackable Header - 8 Pin <https://www.sparkfun.com/products/9279> (PRT-09279) For SCREWTERMINALS and SPRING TERMINALS visit here: Screw Terimnals on SparkFun.com <https://www.sparkfun.com/search/results?term=Screw+Terminals> (5mm/3.5mm/2.54mm spacing) This device is also useful as a general connection point to wire up your design to another part of your project. Our various solder wires solder well into these plated through hole pads. Hook-Up Wire - Assortment (Stranded, 22 AWG) <https://www.sparkfun.com/products/11375> (PRT-11375) Hook-Up Wire - Assortment (Solid Core, 22 AWG) <https://www.sparkfun.com/products/11367> (PRT-11367) View the entire wire category on our website here <https://www.sparkfun.com/categories/141> Special notes: Molex polarized connector foot print use with SKU : PRT-08231 with associated crimp pins and housings. 1MM SMD Version SKU: PRT-10208 NOTES ON THE VARIANTS LOCK and LOCK_LONGPADS... This footprint was designed to help hold the alignment of a through-hole component (i.e. 6-pin header) while soldering it into place. You may notice that each hole has been shifted either up or down by 0.005 of an inch from it's more standard position (which is a perfectly straight line). This slight alteration caused the pins (the squares in the middle) to touch the edges of the holes. Because they are alternating, it causes a "brace" to hold the component in place. 0.005 has proven to be the perfect amount of "off-center" position when using our standard breakaway headers. Although looks a little odd when you look at the bare footprint, once you have a header in there, the alteration is very hard to notice. Also,if you push a header all the way into place, it is covered up entirely on the bottom side.; PROD_ID: CONN-08438
J1 J3 J6 SWD = SparkFun-Connectors:CONN_04: Multi connection point. Often used as Generic Header-pin footprint for 0.1 inch spaced/style header connections On any of the 0.1 inch spaced packages, you can populate with these: Break Away Headers - Straight <https://www.sparkfun.com/products/116> (PRT-00116) Break Away Male Headers - Right Angle <https://www.sparkfun.com/products/553> (PRT-00553) Female Headers <https://www.sparkfun.com/products/115> (PRT-00115) Break Away Headers - Machine Pin <https://www.sparkfun.com/products/117> (PRT-00117) Break Away Female Headers - Swiss Machine Pin <https://www.sparkfun.com/products/743> (PRT-00743) For SCREWTERMINALS and SPRING TERMINALS visit here: Screw Terimnals on SparkFun.com <https://www.sparkfun.com/search/results?term=Screw+Terminals> (5mm/3.5mm/2.54mm spacing) This device is also useful as a general connection point to wire up your design to another part of your project. Our various solder wires solder well into these plated through hole pads. Hook-Up Wire - Assortment (Stranded, 22 AWG) <https://www.sparkfun.com/products/11375> (PRT-11375) Hook-Up Wire - Assortment (Solid Core, 22 AWG) <https://www.sparkfun.com/products/11367> (PRT-11367) View the entire wire category on our website here <https://www.sparkfun.com/categories/141> Special notes: Molex polarized connector foot print use with SKU : PRT-08231 with associated crimp pins and housings. 1MM SMD Version SKU: PRT-10208; PROD_ID: CONN-09696
J4 J7 J8 = SparkFun-Connectors:CONN_02: Multi connection point. Often used as Generic Header-pin footprint for 0.1 inch spaced/style header connections On any of the 0.1 inch spaced packages, you can populate with these: Break Away Headers - Straight <https://www.sparkfun.com/products/116> (PRT-00116) Break Away Male Headers - Right Angle <https://www.sparkfun.com/products/553> (PRT-00553) Female Headers <https://www.sparkfun.com/products/115> (PRT-00115) Break Away Headers - Machine Pin <https://www.sparkfun.com/products/117> (PRT-00117) Break Away Female Headers - Swiss Machine Pin <https://www.sparkfun.com/products/743> (PRT-00743) For SCREWTERMINALS and SPRING TERMINALS visit here: Screw Terimnals on SparkFun.com <https://www.sparkfun.com/search/results?term=Screw+Terminals> (5mm/3.5mm/2.54mm spacing) This device is also useful as a general connection point to wire up your design to another part of your project. Our various solder wires solder well into these plated through hole pads. Hook-Up Wire - Assortment (Stranded, 22 AWG) <https://www.sparkfun.com/products/11375> (PRT-11375) Hook-Up Wire - Assortment (Solid Core, 22 AWG) <https://www.sparkfun.com/products/11367> (PRT-11367) View the entire wire category on our website here <https://www.sparkfun.com/categories/141> Special notes: Molex polarized connector foot print use with: PRT-08233 with associated crimp pins and housings. 2.54_SCREWTERM for use with PRT-10571. 3.5mm Screw Terminal footprints for PRT-08084 5mm Screw Terminal footprints for use with PRT-08432
J5 = SparkFun-Connectors:CONN_05: Multi connection point. Often used as Generic Header-pin footprint for 0.1 inch spaced/style header connections On any of the 0.1 inch spaced packages, you can populate with these: Break Away Headers - Straight <https://www.sparkfun.com/products/116> (PRT-00116) Break Away Male Headers - Right Angle <https://www.sparkfun.com/products/553> (PRT-00553) Female Headers <https://www.sparkfun.com/products/115> (PRT-00115) Break Away Headers - Machine Pin <https://www.sparkfun.com/products/117> (PRT-00117) Break Away Female Headers - Swiss Machine Pin <https://www.sparkfun.com/products/743> (PRT-00743) For SCREWTERMINALS and SPRING TERMINALS visit here: Screw Terimnals on SparkFun.com <https://www.sparkfun.com/search/results?term=Screw+Terminals> (5mm/3.5mm/2.54mm spacing) This device is also useful as a general connection point to wire up your design to another part of your project. Our various solder wires solder well into these plated through hole pads. Hook-Up Wire - Assortment (Stranded, 22 AWG) <https://www.sparkfun.com/products/11375> (PRT-11375) Hook-Up Wire - Assortment (Solid Core, 22 AWG) <https://www.sparkfun.com/products/11367> (PRT-11367) View the entire wire category on our website here <https://www.sparkfun.com/categories/141> Special notes: Molex polarized connector foot print use with SKU : PRT-08231 with associated crimp pins and housings. 1MM SMD Version SKU: PRT-10208
R1-R8 = SparkFun-Resistors:RESISTOR: Generic Resistor Package
U1 = Seeed-OPL-ic:MCU-STM32F103CBT6(LQFP48): 310010004; MPN: STM32F103CBT6
U$1 = EduAreaLib:M95320-D
U$2 = EduAreaLib:PUSHBUTTON
Y1 = SparkFun-FreqCtrl:CRYSTAL: Various standard crystals. Proven footprints.
Y3 = SparkFun-Clocks:CRYSTAL-32.768KHZ: 32.768kHz Crystal Frequency: 32.768kHz Frequency Stability: ±20ppm Load Capacitance: 12.5pF (PTH-2X6 & SMD-3.2X1.5), 6pF (SMD-2X6) SparkFun Products: SparkFun BigTime Watch Kit <https://www.sparkfun.com/products/11734> SparkFun nRF52832 Breakout <https://www.sparkfun.com/products/13990> SparkFun Real Time Clock Module <https://www.sparkfun.com/products/12708>; PROD_ID: XTAL-10112